# EasyEDA schematic sch.json
TITLE: Sheet_1; REV: 1.0; Date: 2024-11-02; Sheet: 1/1; Drawn By: codelife; Company: Your Company
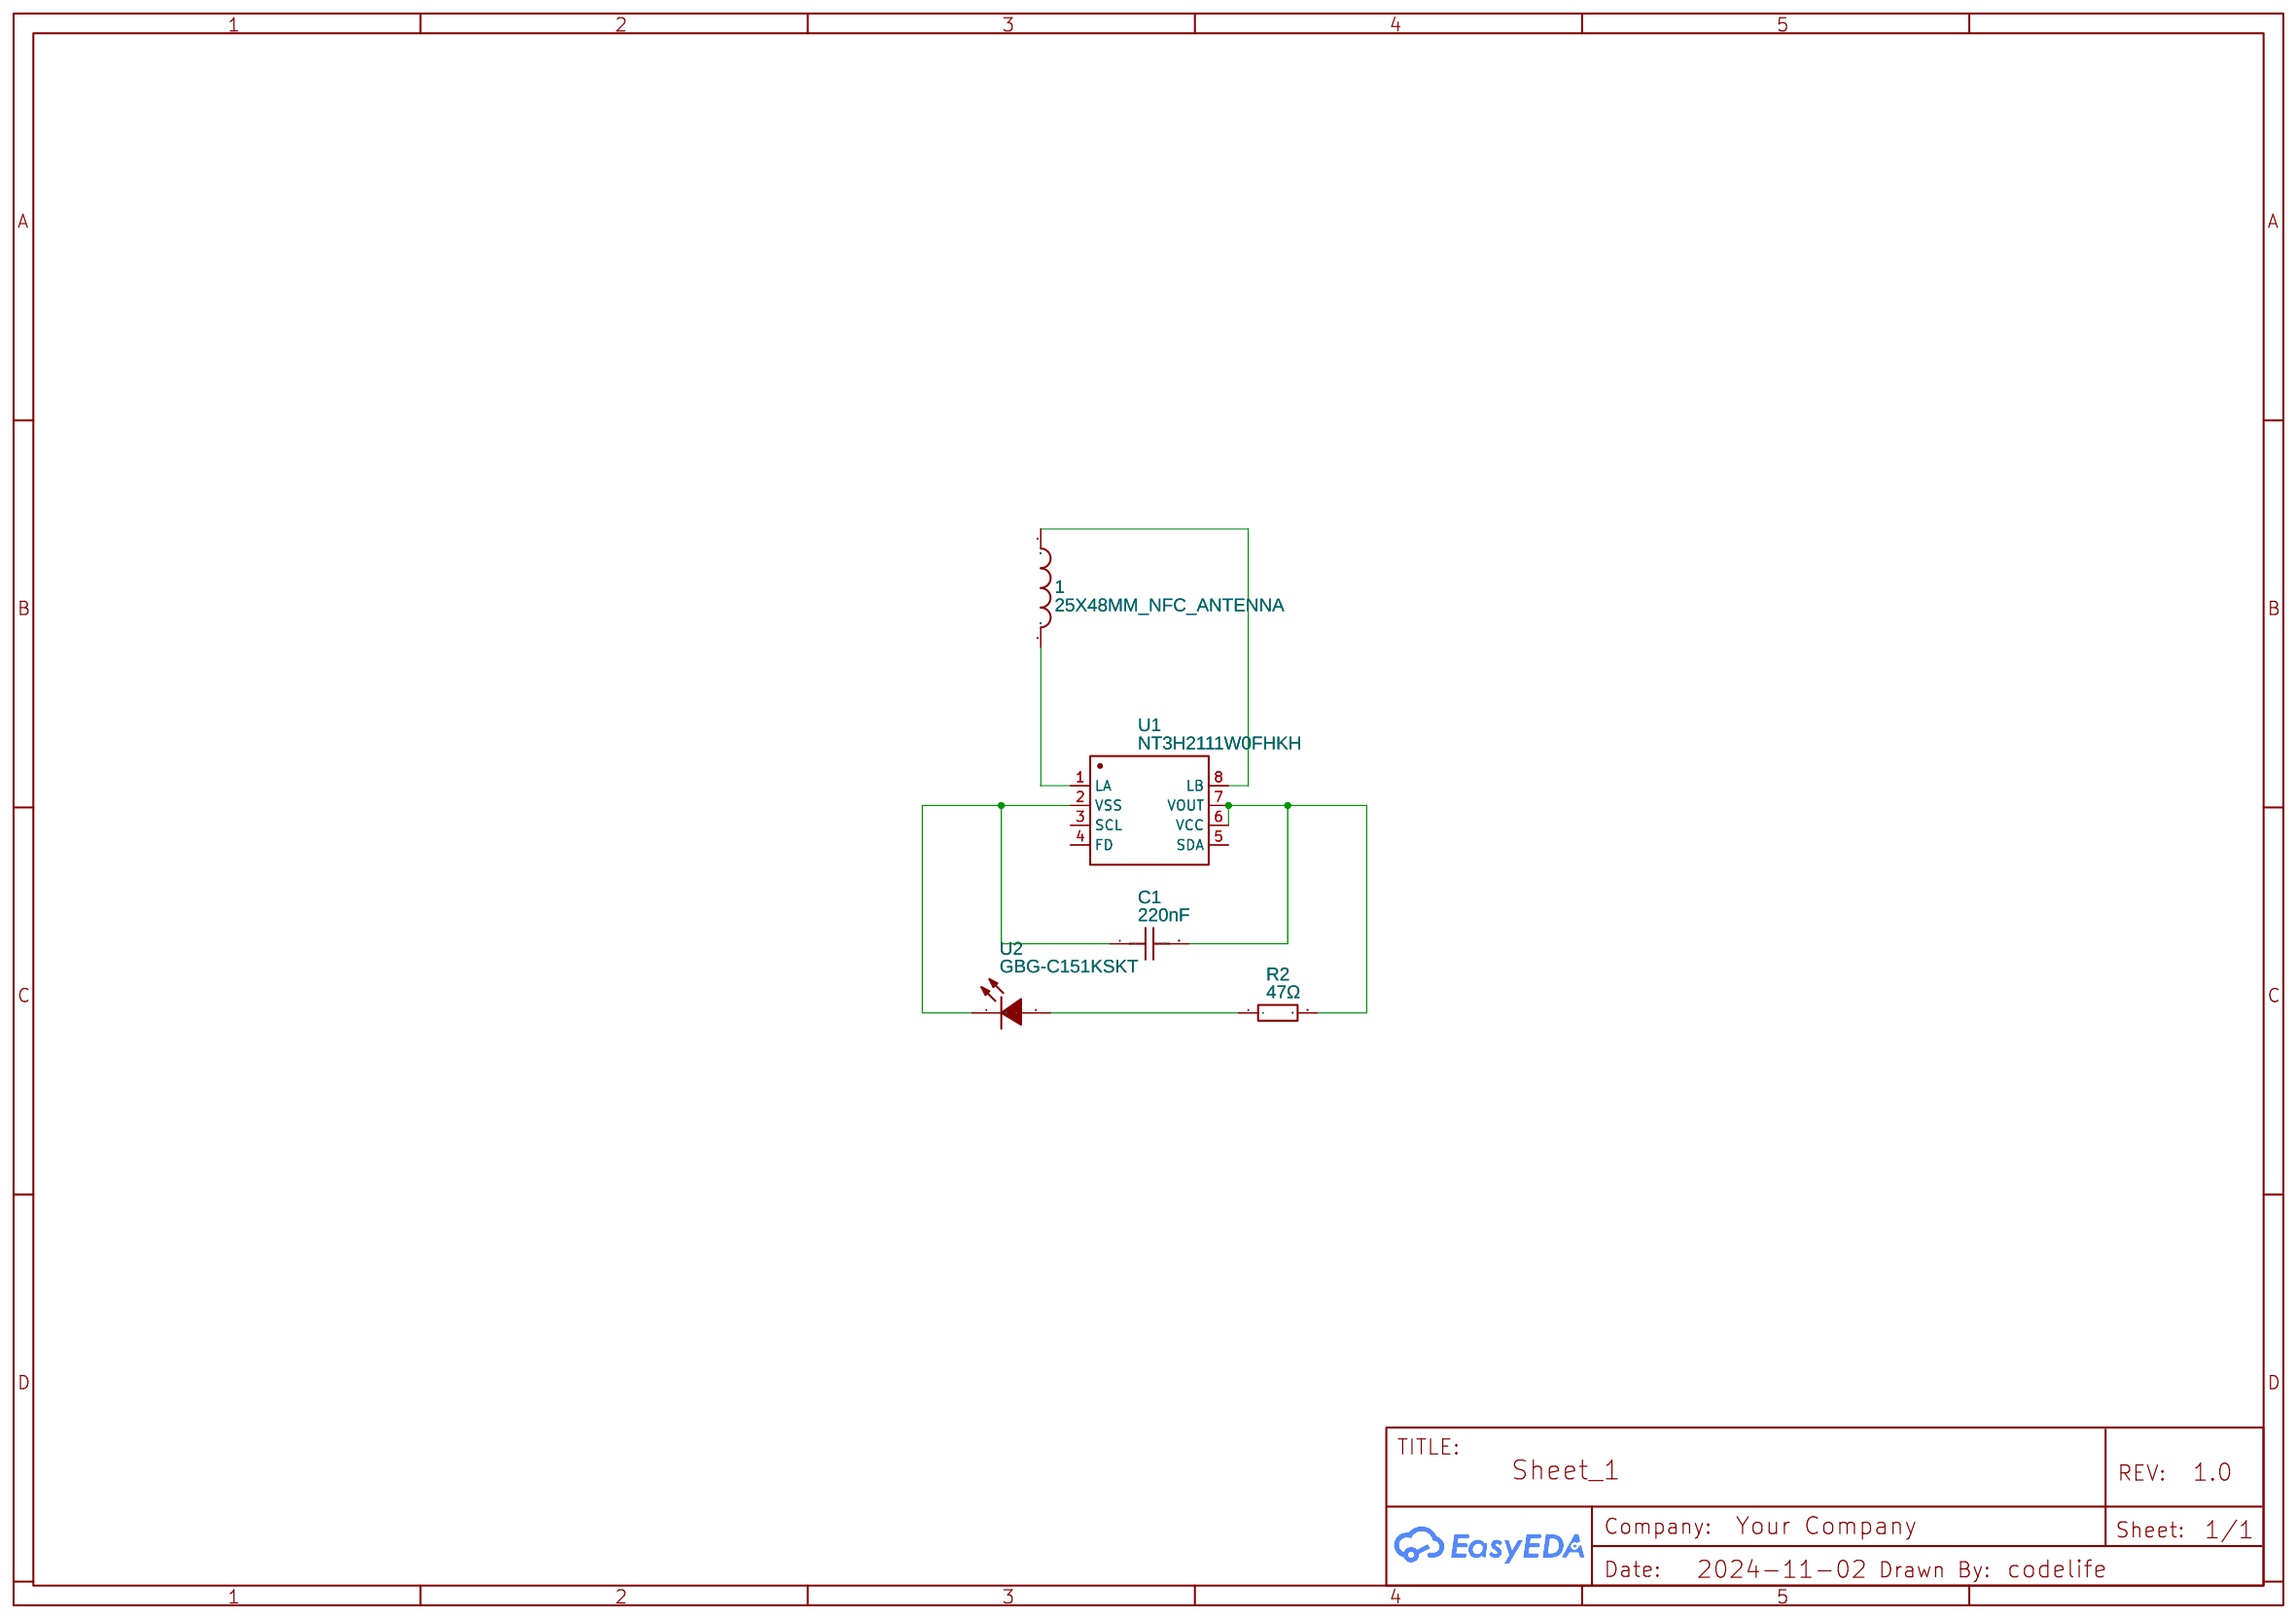
[diagram p0: schematic sheet]

## Parts
1  25X48MM_NFC_ANTENNA  [25X48MM_NFC_ANTENNA]
C1  220nF  [C0402]
R2  47Ω  [R0402]
U1  NT3H2111W0FHKH  [XQFN-8_L1.6-W1.6-P0.50-BL_NT3H2111W0FHKH]
U2  GBG-C151KSKT  [LED1206-RD]

## Library data of the parts
1 = 25X48MM_NFC_ANTENNA: Contributor: LoneWalkerWolf
C1 = 0402X224K160NT: Supplier: LCSC; Supplier Part: C285193; Manufacturer: FH(风华); JLCPCB Part Class: Extended Part; Contributor: lcsc
R2 = 0402WGF470JTCE: Supplier: LCSC; Manufacturer: UNI-ROYAL(厚声); Supplier Part: C25118; JLCPCB Part Class: Extended Part
U1 = NT3H2111W0FHKH: Contributor: LCSC; Supplier: LCSC; Supplier Part: C710403; Manufacturer: NXP(恩智浦); JLCPCB Part Class: Extended Part
U2 = GBG-C151KSKT: Contributor: lcsc; Supplier: LCSC; Supplier Part: C2892183; Manufacturer: GBG

## Nets
Net-(1-P$1): 1.P$1 U1.8(LB)
Net-(1-P$2): 1.P$2 U1.1(LA)
Net-(C1-1): C1.1 U1.2(VSS) U2.1(C)
Net-(C1-2): C1.2 R2.2 U1.6(VCC) U1.7(VOUT)
Net-(R2-1): R2.1 U2.2(A)

Not connected (* = marked no-connect by the designer): U1 3(SCL) 4(FD) 5(SDA)
